# Altium schematic sheet DDC112_Breadboard.SchDoc
size Tabloid; SheetNumber: 1; SheetTotal: 1
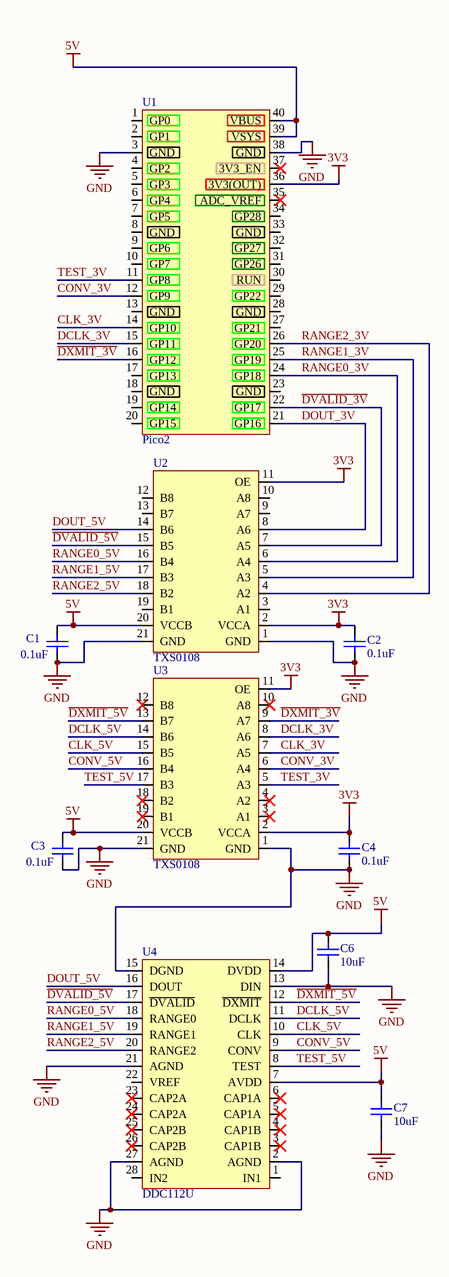
[diagram p0: DDC112_Breadboard.SchDoc]

## Parts
C1  0.1uF
C2  0.1uF
C3  0.1uF
C4  0.1uF
C6  10uF
C7  10uF
U1  Pico2
U2  TXS0108
U3  TXS0108
U4  DDC112U

## Nets
3V3: C2.1 C4.1 U1.36(3V3(OUT)) U2.2(VCCA) U2.11(OE) U3.2(VCCA) U3.11(OE)
5V: C1.1 C3.1 C6.1 C7.1 U1.39(VSYS) U1.40(VBUS) U2.20(VCCB) U3.20(VCCB) U4.7(AVDD) U4.14(DVDD)
GND: C1.2 C2.2 C3.2 C4.2 C6.2 C7.2 U1.3(GND) U1.38(GND) U2.1(GND) U2.21(GND) U3.1(GND) U3.21(GND) U4.2(AGND) U4.13(DIN) U4.15(DGND) U4.21(AGND) U4.27(AGND)
~{DVALID_3V}: U1.22(GP17) U2.7(A5)
~{DVALID_5V}: U2.15(B5) U4.17(~{DVALID})
~{DXMIT_3V}: U1.16(GP12) U3.9(A7)
~{DXMIT_5V}: U3.13(B7) U4.12(~{DXMIT})
CLK_3V: U1.14(GP10) U3.7(A5)
CLK_5V: U3.15(B5) U4.10(CLK)
CONV_3V: U1.12(GP9) U3.6(A4)
CONV_5V: U3.16(B4) U4.9(CONV)
DCLK_3V: U1.15(GP11) U3.8(A6)
DCLK_5V: U3.14(B6) U4.11(DCLK)
DOUT_3V: U1.21(GP16) U2.8(A6)
DOUT_5V: U2.14(B6) U4.16(DOUT)
RANGE0_3V: U1.24(GP18) U2.6(A4)
RANGE0_5V: U2.16(B4) U4.18(RANGE0)
RANGE1_3V: U1.25(GP19) U2.5(A3)
RANGE1_5V: U2.17(B3) U4.19(RANGE1)
RANGE2_3V: U1.26(GP20) U2.4(A2)
RANGE2_5V: U2.18(B2) U4.20(RANGE2)
TEST_3V: U1.11(GP8) U3.5(A3)
TEST_5V: U3.17(B3) U4.8(TEST)

Not connected (* = marked no-connect by the designer): U1 1(GP0) 2(GP1) 4(GP2) 5(GP3) 6(GP4) 7(GP5) 8(GND) 9(GP6) 10(GP7) 13(GND) 17(GP13) 18(GND) 19(GP14) 20(GP15) 23(GND) 27(GP21) 28(GND) 29(GP22) 30(RUN) 31(GP26) 32(GP27) 33(GND) 34(GP28) 35(ADC_VREF)* 37(3V3_EN)*; U2 3(A1) 9(A7) 10(A8) 12(B8) 13(B7) 19(B1); U3 3(A1)* 4(A2)* 10(A8)* 12(B8)* 18(B2)* 19(B1)*; U4 1(IN1) 3(CAP1B)* 4(CAP1B)* 5(CAP1A)* 6(CAP1A)* 22(VREF) 23(CAP2A)* 24(CAP2A)* 25(CAP2B)* 26(CAP2B)* 28(IN2)

## Library data of the parts
C1-C4 C6 C7 = CAP: Cap, Nonpolar, Any, Must choose footprint manually
U1 = Pico2: Raspberry Pi RP2350 Board 40DIP
U2 U3 = TXS0108: 8-BitBi-Directional, Level-Shifting, Voltage Translator for Open-Drain and Push-Pull Applications 20VQFN/21DIP
U4 = DDC112U: Dual Current Input 20-Bit ADC 28SOIC